# EAGLE design MicroTeleinfo-V1.1 (EAGLE 7.5.0)
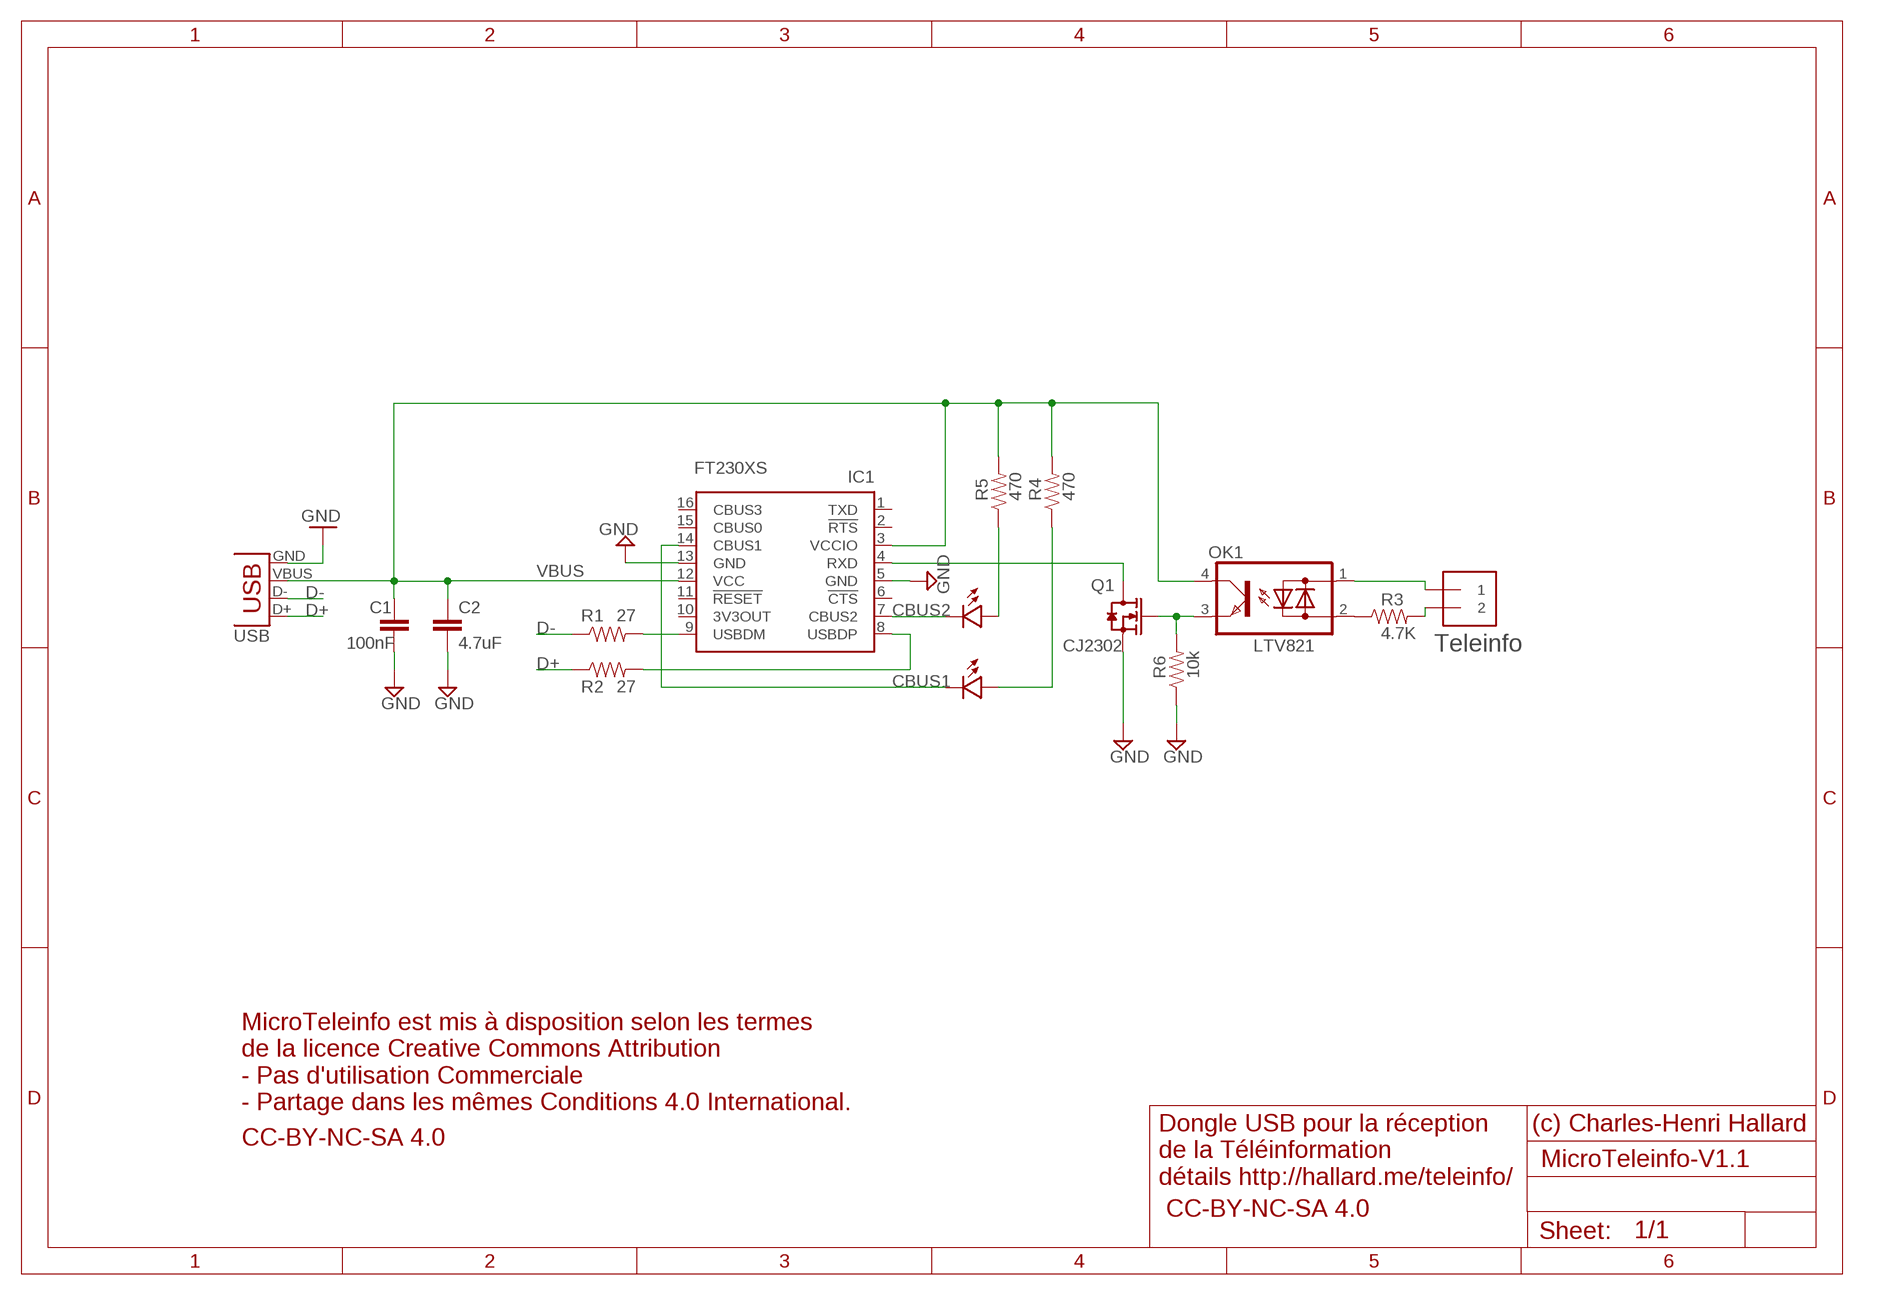
[diagram p0: schematic, sheet 1]

## Parts
C1  100nF  CAP0603-CAP  [0603-CAP]
C2  4.7uF  CAP0805-CAP  [0805-CAP]
IC1  FT230XS  [SSOP16]
LED1  Green  LED0805  [0805-LED]
LED2  Red  LED0805  [0805-LED]
OK1  LTV821  SFH6206  [DIL4-SMD]
Q1  CJ2302  MOSFET-N-''  [SOT23]
R1  27  RESISTOR0603-RES  [0603-RES]
R2  27  RESISTOR0603-RES  [0603-RES]
R3  4.7K  RESISTOR0805-RES  [0805-RES]
R4  470  RESISTOR0603-RES  [0603-RES]
R5  470  RESISTOR0603-RES  [0603-RES]
R6  10k  RESISTOR0603-RES  [0603-RES]
TELEINFO  1X2-3.5MM  [1X2-3.5MM]
USB  USBNOSILK  [USB-A-H_NO_SILK]

## Nets
CBUS1: IC1.14(CBUS1) LED1.MINUS
CBUS2: IC1.7(CBUS2) LED2.MINUS
D+: R2.1 USB.D+
D-: R1.1 USB.D-
GND: C1.2 C2.2 IC1.5(GND) IC1.13(GND) Q1.2(S) R6.1 USB.GND
N$1 [power]: OK1.3(E) Q1.1(G) R6.2
N$3: OK1.2(AC2) R3.1
N$4: OK1.1(AC1) TELEINFO.1
N$5: R3.2 TELEINFO.2
N$6: LED1.PLUS R4.1
N$7: LED2.PLUS R5.1
N$8: IC1.4(RXD) Q1.3(D)
USBDM: IC1.9(USBDM) R1.2
USBDP: IC1.8(USBDP) R2.2
VBUS: C1.1 C2.1 IC1.3(VCCIO) IC1.12(VCC) OK1.4(C) R4.2 R5.2 USB.VBUS
Unconnected: IC1.1(TXD) IC1.2(!RTS) IC1.6(!CTS) IC1.10(3V3OUT) IC1.11(!RESET) IC1.15(CBUS0) IC1.16(CBUS3)

## Notes on the sheet
- Teleinfo
- MicroTeleinfo est mis à disposition selon les termes
  de la licence Creative Commons Attribution
  - Pas d'utilisation Commerciale 
  - Partage dans les mêmes Conditions 4.0 International.
- (c) Charles-Henri Hallard
- CC-BY-NC-SA 4.0
- Dongle USB pour la réception
  de la Téléinformation
  détails http://hallard.me/teleinfo/
- CC-BY-NC-SA 4.0

## Library data of the parts
C1 = LowPowerLab:CAP: Capacitor Standard 0603 ceramic capacitor, and 0.1" leaded capacitor.
C2 = _c2h:CAP: Capacitor Standard 0603 ceramic capacitor, and 0.1" leaded capacitor.
IC1 = ftdichip:FT230X: USB to BASIC UART IC Auto generated by make-symbol-device-package-bsdl.ulp Rev. 43 Source: Data sheet <http://www.ftdichip.com/Support/Documents/DataSheets/ICs/DS_FT230X.pdf>
LED1 LED2 = LowPowerLab:LED
OK1 = optocoupler:SFH620: Optocoupler, Phototransistor Output, AC Input Source: http://www.vishay.com/docs/83675/sfh620.pdf; MF: VISHAY/TELEFUNKEN; MPN: SFH6206-3; OC_FARNELL: 1469585; OC_NEWARK: 58K2214
Q1 = Seeed-Discrete:MOSFET-N: CJ2302：SMD MOSFET N-CH 20V-2.1A
R1 R2 R4-R6 = LowPowerLab:RESISTOR: Resistor Basic schematic elements and footprints for 0603, 1206, and PTH resistors.
R3 = _c2h:RESISTOR: Resistor Basic schematic elements and footprints for 0603, 1206, and PTH resistors.
TELEINFO = adafruit:1X2: 3.5mm Terminal block http://www.ladyada.net/library/pcb/eaglelibrary.html
USB = SparkFun-Connectors:USB: USB Connectors USB-B-PTH is fully proven SKU : PRT-00139/CONN-08278 USB-miniB is fully proven SKU : PRT-00587 USB-A-PCB is untested. USB-A-H is throughly reviewed, but untested. Spark Fun Electronics SKU : PRT-00437 USB-B-SMT is throughly reviewed, but untested. Needs silkscreen touching up. USB-A-S has not been used/tested USB-MB-H has not been used/tested USB-MICROB has been used. CONN-09505

## Net classes
1 power: width 0.305 mm

## Board
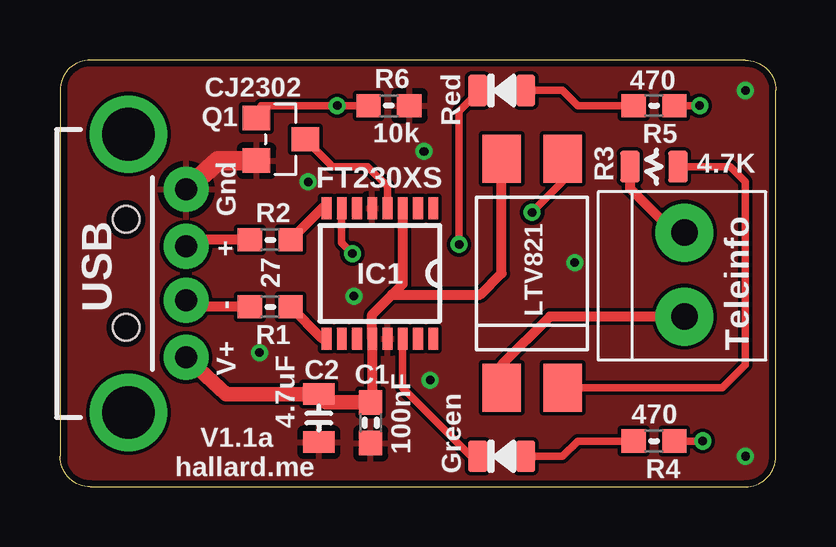
[diagram p1: board, top side]
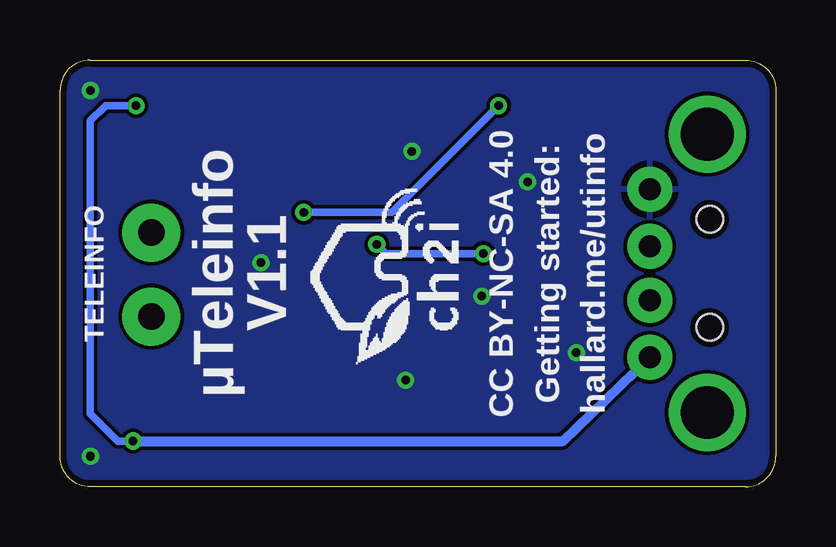
[diagram p2: board, bottom side, seen from below]

Size 29.85 x 17.78 mm. Coordinates in mm from the lower left corner, seen from the top.
Outline: 1.27,0 28.57,0 arc90 29.85,1.27 29.85,16.51 arc90 28.57,17.78 1.27,17.78 arc90 0,16.51 0,1.27 arc90 1.27,0
Copper layers (1*16): Top 0.035mm / dielectric 1.5mm / Bottom 0.035mm
Design rules "SeeedStudio_2layer_DRU_no_angle_20140221": minimum track width 6mil, minimum drill 12mil, track to track 6mil, track to pad 6mil, pad to pad 6mil, via to via 6mil, smd to smd 0mil, copper to edge 10mil, drill to drill 10mil, minimum pad ring 10mil, minimum via ring 6mil, stop-mask expansion 2mil, vias tented up to drill 100mil, thermal gap 10mil

### Footprints (pad centres in the part's own frame; a part is rotated, then mirrored left to right if it is on the bottom)
0603-CAP = smd 1.016 x 0.965: 1 -0.85,0; 2 0.85,0
0805-CAP = smd 0.902 x 1.3: 1 -1,0; 2 1,0
SSOP16 = smd 0.914 x 0.406: 1 -2.718,2.223; 2 -2.718,1.587; 3 -2.718,0.953; 4 -2.718,0.318; 5 -2.718,-0.318; 6 -2.718,-0.953; 7 -2.718,-1.587; 8 -2.718,-2.223; 9 2.718,-2.223; 10 2.718,-1.587; 11 2.718,-0.953; 12 2.718,-0.318; 13 2.718,0.318; 14 2.718,0.953; 15 2.718,1.587; 16 2.718,2.223
0805-LED = smd 0.8 x 1.3: MINUS -1,0; PLUS 1,0
DIL4-SMD = smd 1.6 x 2: 1 -1.27,-4.77; 2 1.27,-4.77; 3 1.27,4.77; 4 -1.27,4.77
SOT23 = smd 1.016 x 1.143: 1 -0.889,-1.016; 2 0.889,-1.016; 3 0,1.016
0603-RES = smd 1.016 x 0.965: 1 -0.85,0; 2 0.85,0
0805-RES = smd 0.8 x 1.3: 1 -1,0; 2 1,0
1X2-3.5MM = drill 1.1 pad 2.413: 1 1.8,0; 2 -1.7,0
USB-A-H_NO_SILK = drill 0.914 pad 1.88: D+ 2.4,1.127; D- 2.4,-1.127; GND 2.4,3.5; VBUS 2.4,-3.5 | drill 2.2: GND2 0,-5.8; GND3 0,5.8 | hole 1.1: -0.1,2.25; -0.1,-2.25

### Placement (x,y rotation side)
C1  12.95,2.67 270 top
C2  10.8,2.86 270 top
IC1  13.34,8.89 270 top
LED1  18.42,1.27 0 top
LED2  18.42,16.51 0 top
OK1  19.68,8.89 0 top
Q1  9.21,14.48 270 top
R1  8.76,7.49 0 top
R2  8.76,10.29 0 top
R3  24.77,13.34 180 top
R4  24.77,1.91 0 top
R5  24.77,15.88 0 top
R6  13.72,15.88 180 top
TELEINFO  26.04,8.89 270 top
U$1  [LOGO_CH2I_75MM]  15.24,9.21 90 bottom
USB  2.86,8.89 0 top

### Tracks (layer width: path | path; a pad name or v marks a point on that pad's centre or on a via)
CBUS1
  Top 0.305: IC1.14 14.29,4.13 17.14,1.27 LED1.MINUS
CBUS2  (via drill 0.36 pad 0.71)
  Top 0.305: LED2.MINUS 17.42,16.41 16.64,15.64 16.64,11.43 16.64,10.92 v16.64,10.1 | IC1.7 11.75,10.16 v12.19,9.72
  Bottom 0.305: v12.19,9.72 16.26,9.72 v16.64,10.1
D+
  Top 0.406: R2.1 5.66,10.29 USB.D+
D-
  Top 0.406: R1.1 5.66,7.49 USB.D-
GND  (via drill 0.36 pad 0.71)
  Top 0.813: Q1.2 6.58,13.59 USB.GND
  other vias: 21.46,9.33 15.43,4.45 15.18,13.97 12.26,7.94 28.57,16.51 28.57,1.27 8.32,5.59 10.35,12.7
  pour Top: 0.38,20.19 30.48,20.19 30.48,-2.03 0.38,-2.03
  pour Bottom: -0.76,19.68 31.5,19.68 31.5,-0.76 -0.76,-0.76
N$1  (via drill 0.36 pad 0.71)
  Top 0.305: OK1.3 20.96,12.7 v19.68,11.43 | R6.2 v11.56,15.88 8.38,15.88 Q1.1
  Bottom 0.305: v11.56,15.88 16,11.43 v19.68,11.43
N$3
  Top 0.305: R3.1 27.94,13.34 28.57,12.7 28.57,5.08 27.61,4.12 OK1.2
N$4
  Top 0.406: TELEINFO.1 20.43,7.09 18.42,5.08 OK1.1
N$5
  Top 0.406: 26.02,10.61 TELEINFO.2 25.61,10.59 23.77,12.43 R3.2
N$6
  Top 0.305: R4.1 21.59,1.91 20.96,1.27 LED1.PLUS
N$7
  Top 0.305: R5.1 21.59,15.88 20.96,16.51 LED2.PLUS
N$8
  Top 0.305: Q1.3 11.37,13.34 12.83,13.34 13.65,12.51 IC1.4
USBDM
  Top 0.305: IC1.9 11.06,6.17
  Top 0.406: 11.06,6.17 10.93,6.17 R1.2
USBDP
  Top 0.305: IC1.8 11.06,11.61
  Top 0.406: 11.06,11.61 10.93,11.61 R2.2
VBUS  (via drill 0.36 pad 0.71)
  Top 0.305: R5.2 v26.67,15.88 | v26.8,1.91 R4.2
  Top 0.406: 13.84,8 17.53,8 18.42,8.89 OK1.4 | C1.1 13.02,3.96 IC1.12 13.02,7.18 13.84,8 | IC1.3 14.29,8.45 13.84,8
  Top 0.61: C1.1 11.09,3.52 C2.1 6.92,3.86 USB.VBUS
  Bottom 0.305: v26.67,15.88 27.94,15.88 28.57,15.24 28.57,3.05 27.43,1.91 v26.8,1.91
  Bottom 0.406: v26.8,1.91 8.87,1.91 USB.VBUS

### Text on the board
tPlace: V1.1a
bPlace: hallard.me/utinfo | Getting started:
tNames: Gnd | + | - | V+ | Teleinfo | hallard.me
bNames: CC BY-NC-SA 4.0 | V1.1 | µTeleinfo
_tNames: R6 | Q1 | R5 | R3 | R2 | USB | IC1 | R1 | C2 | C1 | R4